# EAGLE design commutator-controller (EAGLE 8.3.2)
DESIGNER: Jon Newman, Jakob Voigts; DESIGN_NAME: Commutator Control Board; LICENSE: CC BY-NC-SA 4.0; REVISION: 1.1
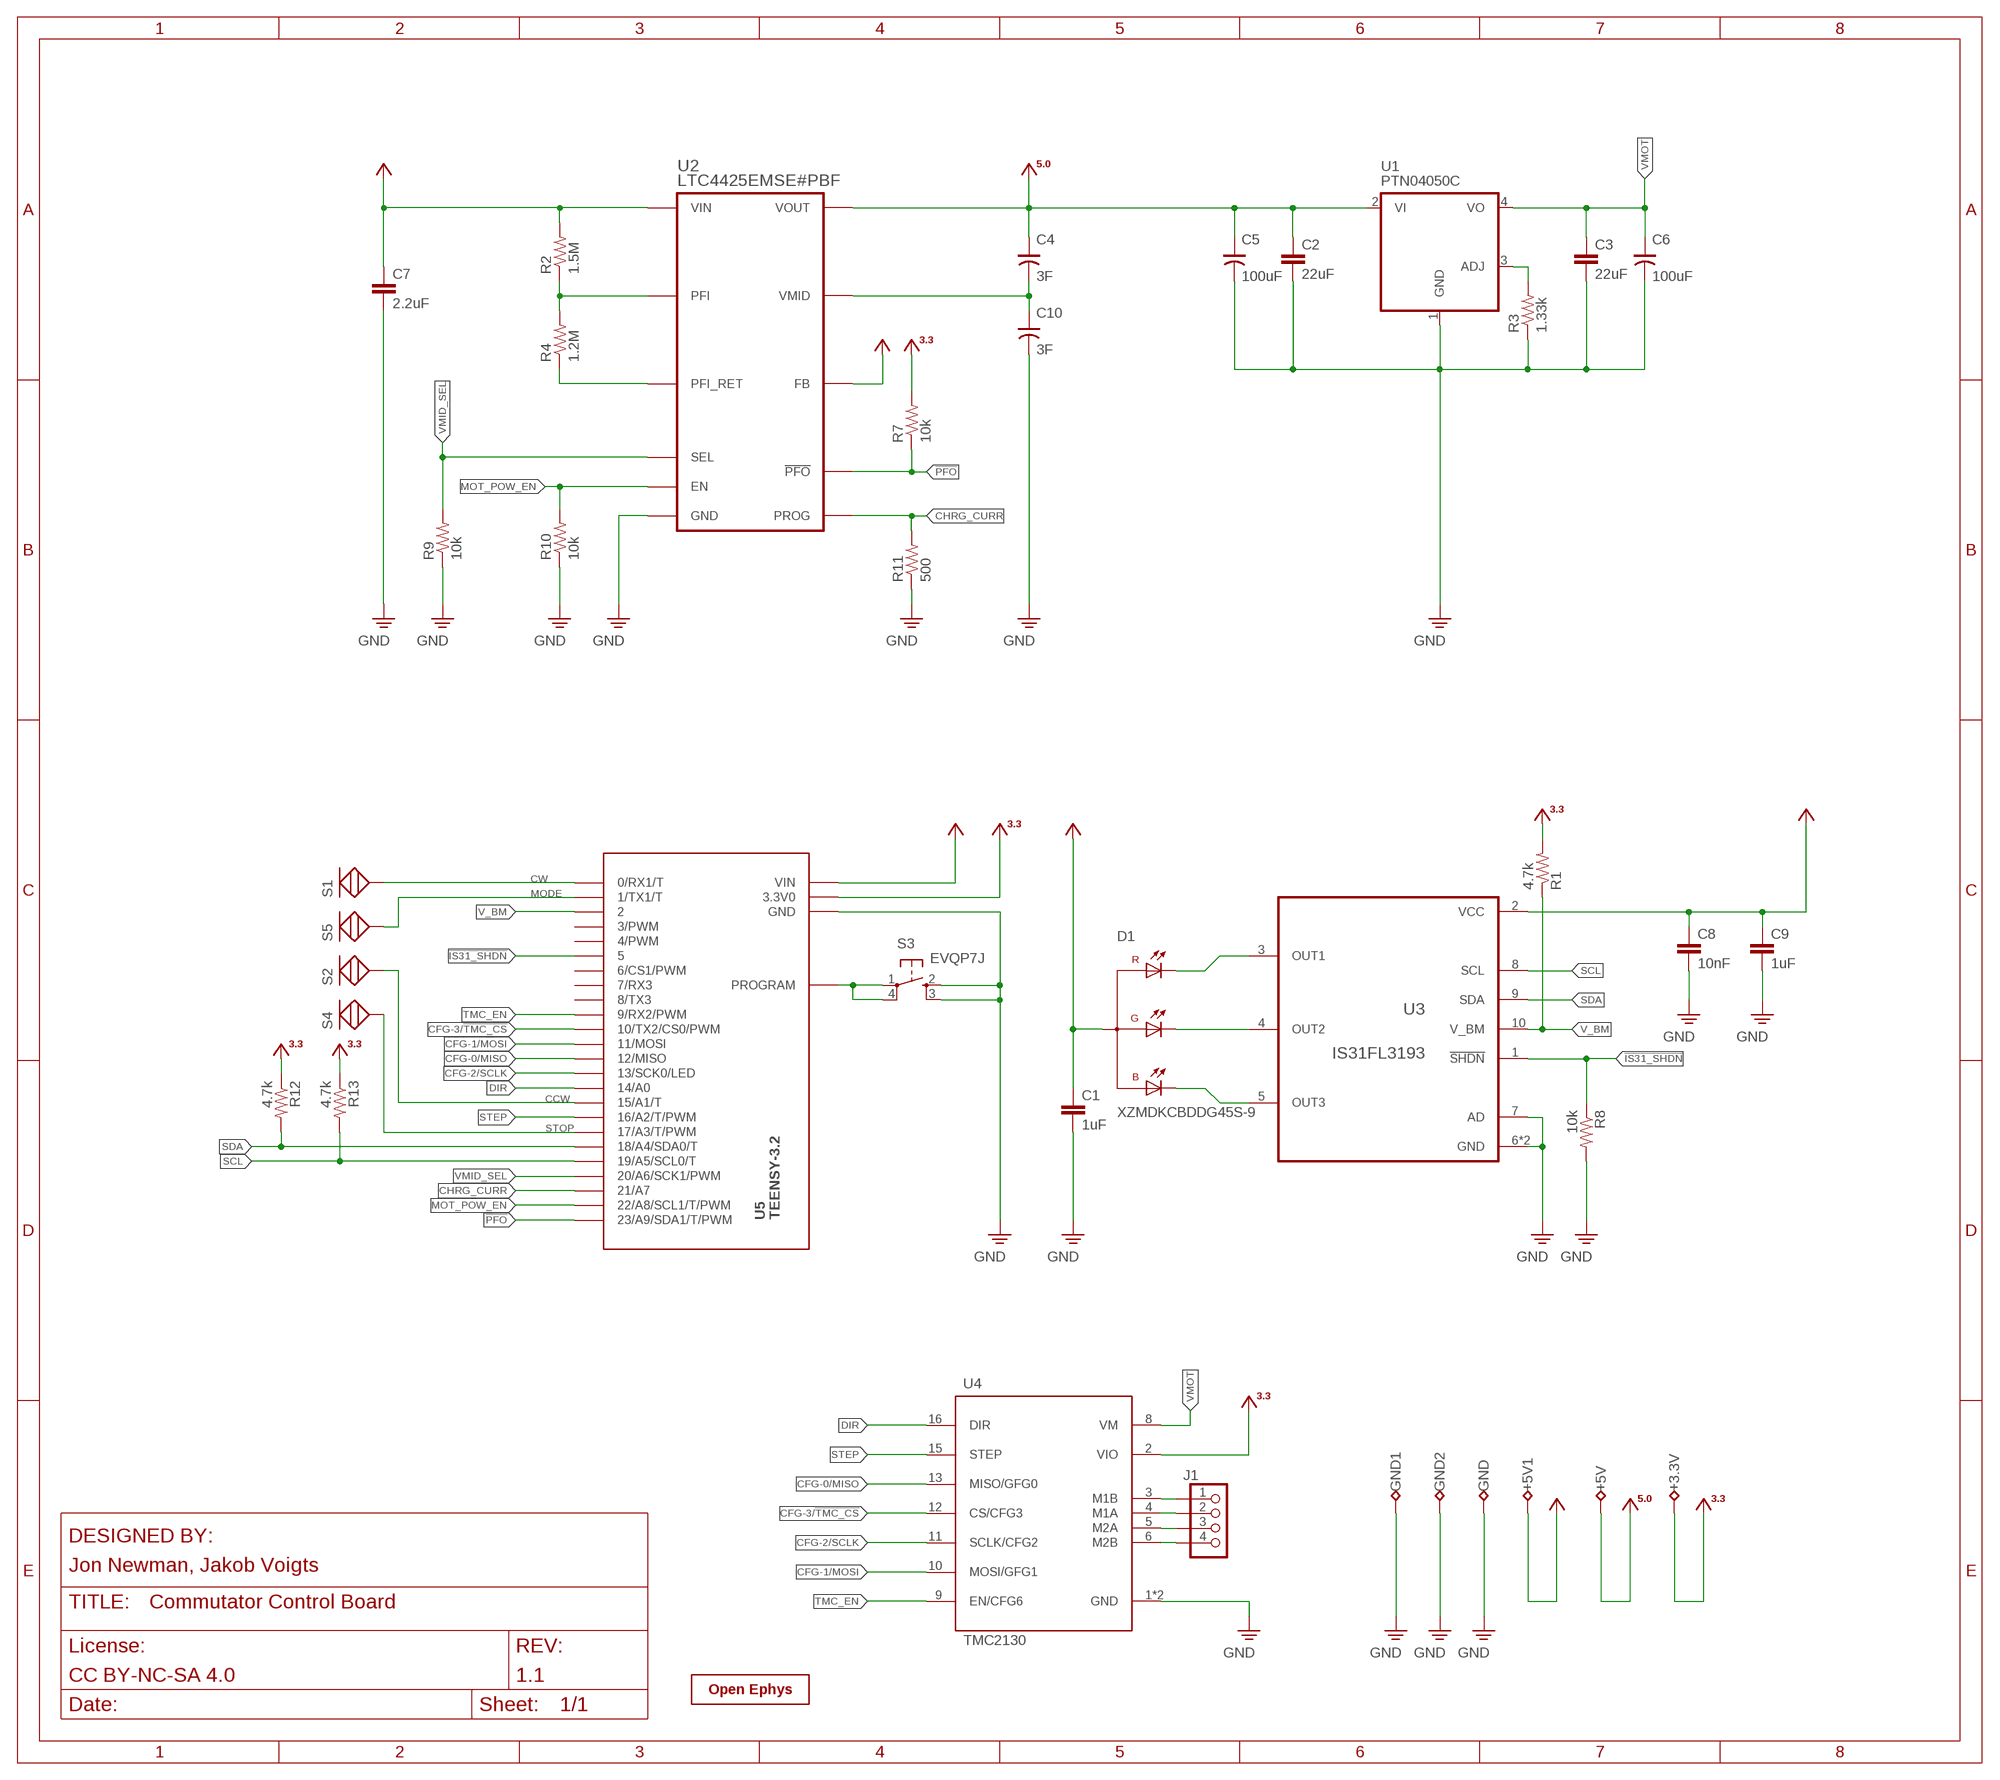
[diagram p0: schematic, sheet 1]

## Parts
+3.3V  TPB2,54  [B2,54]
+5V  TPB2,54  [B2,54]
+5V1  TPB2,54  [B2,54]
C1  1uF  C_0603  [0603]
C2  22uF  C_1206  [1206]
C3  22uF  C_1206  [1206]
C4  3F  C-POL_1210  [1210-POL]
C5  100uF  C-POL_0807  [153CLV-0807]
C6  100uF  C-POL_0807  [153CLV-0807]
C7  2.2uF  C_0805  [0805]
C8  10nF  C_0603  [0603]
C9  1uF  C_0603  [0603]
C10  3F  C-POL_1210  [1210-POL]
D1  XZMDKCBDDG45S-9  LED-RGB_PLCC-INVERTED-NOHOLE  [PLCC-INVERTED-NOHOLE]
GND  TPB2,54  [B2,54]
GND1  TPB2,54  [B2,54]
GND2  TPB2,54  [B2,54]
J1  PINHD-1X4_SMD-0.1"  [JP4_SMD]
R1  4.7k  R_0603  [0603]
R2  1.5M  R_0603  [0603]
R3  1.33k  R_0603  [0603]
R4  1.2M  R_0603  [0603]
R7  10k  R_0603  [0603]
R8  10k  R_0603  [0603]
R9  10k  R_0603  [0603]
R10  10k  R_0603  [0603]
R11  500  R_0603  [0603]
R12  4.7k  R_0603  [0603]
R13  4.7k  R_0603  [0603]
S1  TOUCH_1MM  [TOUCH-1MM]
S2  TOUCH_1MM  [TOUCH-1MM]
S3  EVQP7J  SPST_TACT_EVQP7  [EVQP7]
S4  TOUCH_1MM  [TOUCH-1MM]
S5  TOUCH_1MM  [TOUCH-1MM]
U1  PTN04050C  VREG_ADJ_R-PDSS-B4  [PDSS-B4-MODULE]
U2  LTC4425EMSE#PBF  LTC4425_MSOP  [MSOP-12-PAD]
U3  IS31FL3193  [PWSON-N10-3X3]
U4  TMC2130  SILENT-STEPPER-STICK-TMC2130_SMD  [SILENT-STEPPER-STICK-SMD]
U5  TEENSY-3.2  TEENSY_LC_SMD  [TEENSY_LC_SMD]
X1  OE-LOGO_7X5  [OE-LOGO-7X5]

## Nets
!IS31_SHDN: R8.1 U3.1(!SHDN) U5.5
!PFO: R7.1 U2.8(!PFO) U5.23(23/A9/SDA1/T/PWM)
+3V3: +3.3V.TP R1.2 R7.2 R12.1 R13.1 U4.2(VIO) U5.3.3(3.3V0) U5.3V3(3.3V0)
+5V0: +5V.TP C2.1 C4.+ C5.+ U1.2(VI) U2.1(VOUT) U2.2(VOUT)
CCW: S2.PAD U5.15(15/A1/T)
CFG-0/MISO: U4.13(MISO/GFG0) U5.12(12/MISO)
CFG-1/MOSI: U4.10(MOSI/GFG1) U5.11(11/MOSI)
CFG-2/SCLK: U4.11(SCLK/CFG2) U5.13(13/SCK0/LED)
CFG-3/!TMC_CS: U4.12(CS/CFG3) U5.10(10/TX2/CS0/PWM)
CHRG_CURR: R11.2 U2.3(PROG) U5.21(21/A7)
CW: S1.PAD U5.0(0/RX1/T)
DIR: U4.16(DIR) U5.14(14/A0)
GND: C1.2 C2.2 C3.2 C5.- C6.- C7.2 C8.2 C9.2 C10.- GND1.TP GND2.TP GND.TP R3.1 R8.2 R9.1 R10.1 R11.1 S3.2(S) S3.3(S1) U1.1(GND) U2.PAD(GND) U3.6(GND) U3.7(AD) U3.PAD(GND) U4.1(GND) U4.7(GND) U5.GND U5.GND1(GND) U5.GND2(GND)
MODE: S5.PAD U5.1(1/TX1/T)
MOT_POW_EN: R10.2 U2.6(EN) U5.22(22/A8/SCL1/T/PWM)
N$1: R4.1 U2.7(PFI_RET)
N$2: R2.1 R4.2 U2.9(PFI)
N$3: D1.1(CR) U3.3(OUT1)
N$5: J1.1 U4.3(M1B)
N$6: J1.2 U4.4(M1A)
N$7: J1.3 U4.5(M2A)
N$8: J1.4 U4.6(M2B)
N$9: R3.2 U1.3(ADJ)
N$10: D1.4(CG) U3.4(OUT2)
N$14: C4.- C10.+ U2.10(VMID)
N$45: D1.3(CB) U3.5(OUT3)
PROGRAM: S3.1(P) S3.4(P1) U5.PROGRAM
SCL: R13.2 U3.8(SCL) U5.19(19/A5/SCL0/T)
SDA: R12.2 U3.9(SDA) U5.18(18/A4/SDA0/T)
STEP: U4.15(STEP) U5.16(16/A2/T/PWM)
STOP: S4.PAD U5.17(17/A3/T/PWM)
TMC_EN: U4.9(EN/CFG6) U5.9(9/RX2/PWM)
V_BM: R1.1 U3.10(V_BM) U5.2
VCC: +5V1.TP C1.1 C7.1 C8.1 C9.1 D1.2(A) R2.2 U2.5(FB) U2.11(VIN) U2.12(VIN) U3.2(VCC) U5.VIN
VMID_SEL: R9.2 U2.4(SEL) U5.20(20/A6/SCK1/PWM)
VMOT: C3.1 C6.+ U1.4(VO) U4.8(VM)
Unconnected: U5.3(3/PWM) U5.4(4/PWM) U5.6(6/CS1/PWM) U5.7(7/RX3) U5.8(8/TX3)

## Library data of the parts
+3.3V +5V +5V1 GND GND1 GND2 = jonnew:TP: Test pad
C1-C3 C8 C9 = jonnew:C: Capacitor
C4-C6 C10 = jonnew:C-POL: Polarized Capacitor
C7 = jonnew:C: Capacitor; MN: TDK Corp.; PARTNO: C2012X5R1Cxxxxxxx; VID: DK
D1 = jonnew:LED-RGB
J1 = jonnew:PINHD-1X4
R1-R4 R7-R13 = jonnew:R: Resistor; DK: PxxxxHTR-ND; MN: Panasonic; MPN: ERJ-3EKFxxxxV
S1 S2 S4 S5 = jonnew:TOUCH
S3 = jonnew:SPST_TACT: SMT 6mm switch, EVQQ2 series http://www.ladyada.net/library/eagle
U1 = jonnew:VREG_ADJ
U2 = jonnew:LTC4425
U3 = jonnew:IS31FL3193
U4 = jonnew:SILENT-STEPPER-STICK-TMC2130
U5 = jonnew:TEENSY_LC_SMD
X1 = jonnew:OE-LOGO

## Board
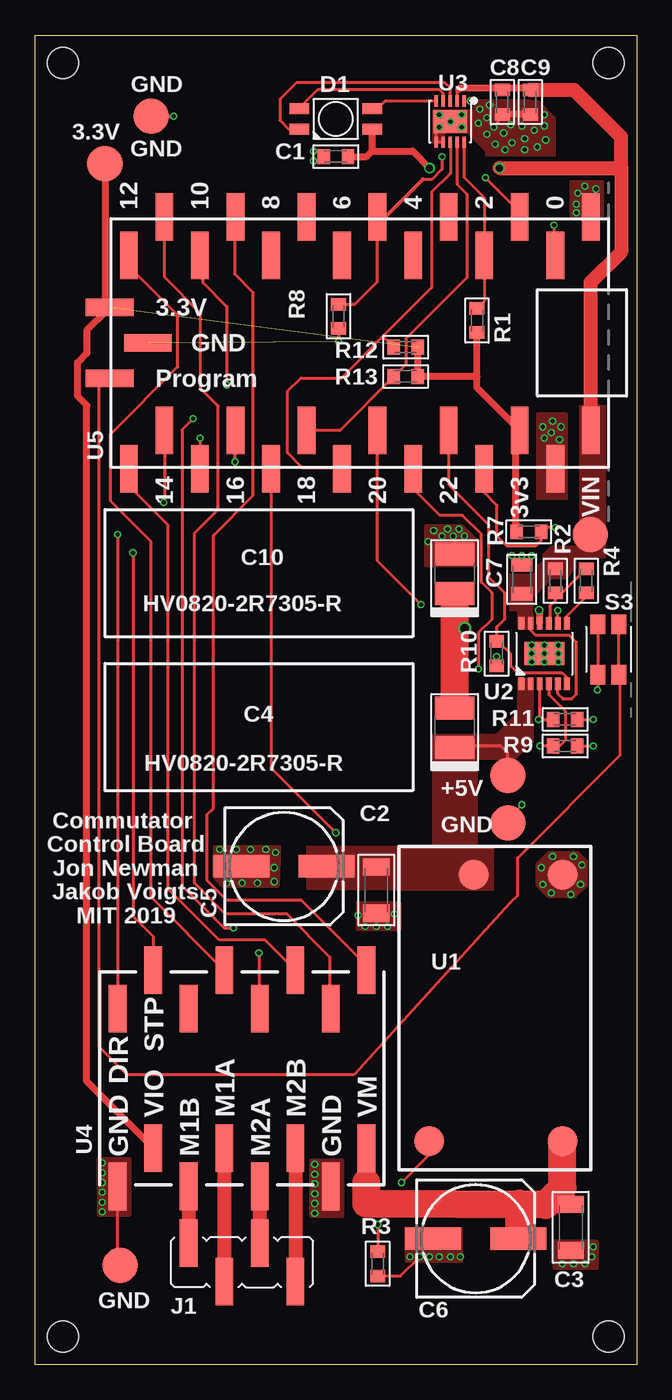
[diagram p1: board, top side]
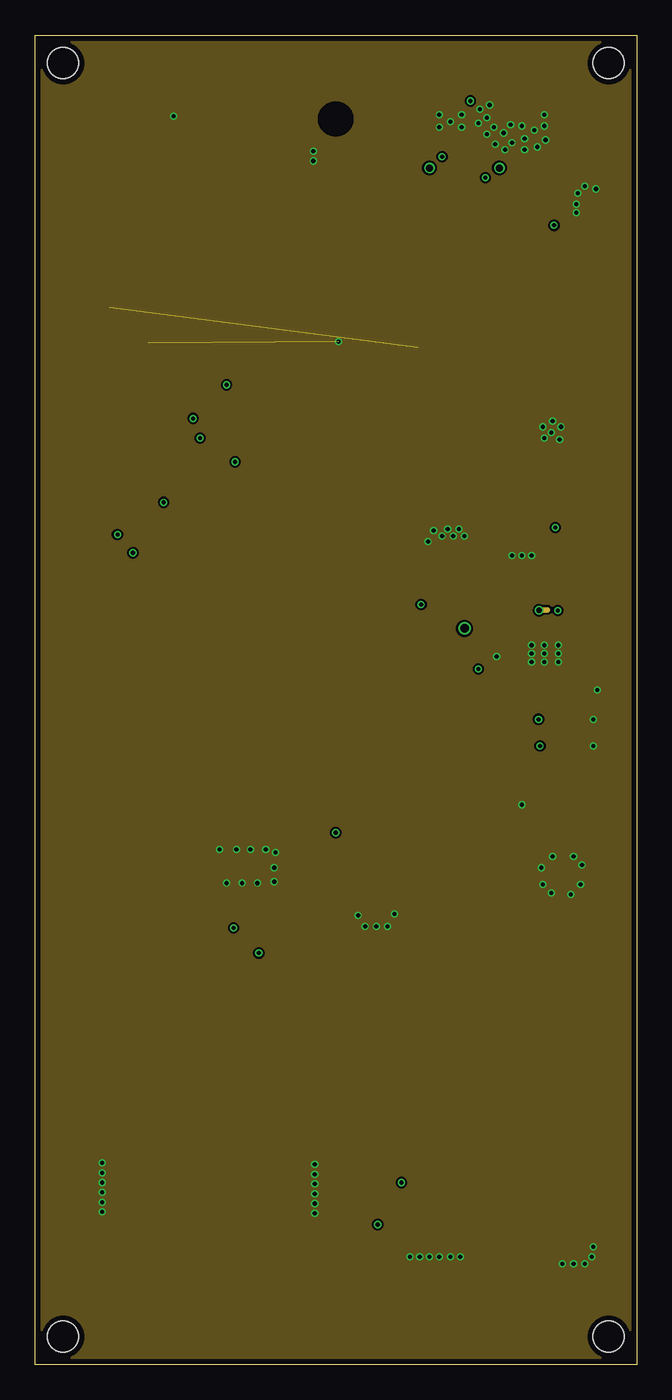
[diagram p2: board, inner layer Route2]
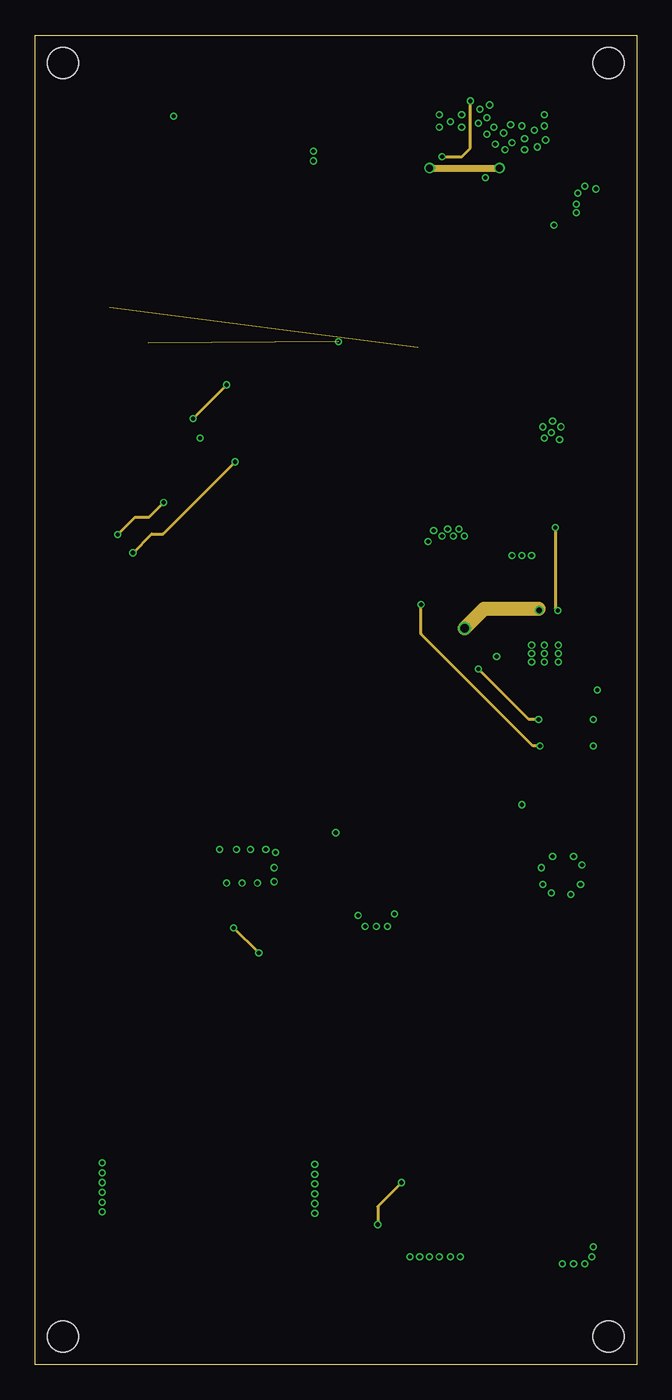
[diagram p3: board, inner layer Route15]
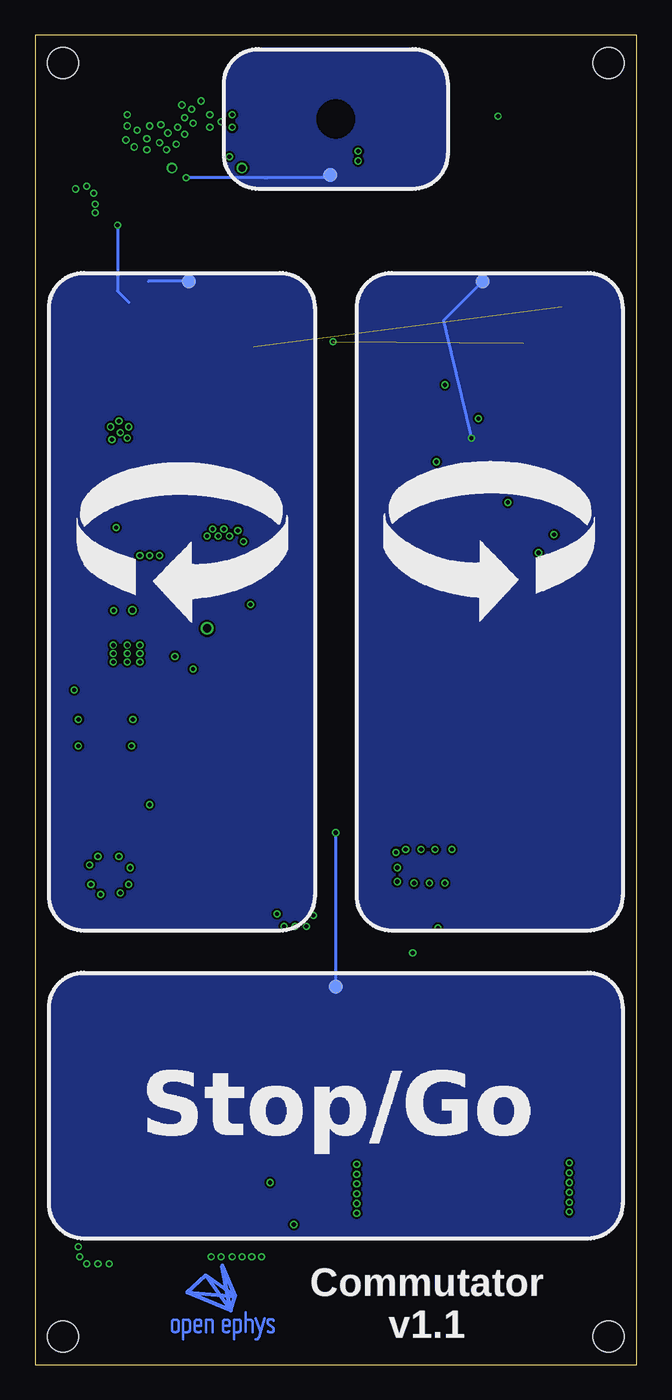
[diagram p4: board, bottom side, seen from below]

Size 43 x 95 mm. Coordinates in mm from the lower left corner, seen from the top.
Outline: 0,0 0,95 43,95 43,0 0,0
Copper layers (1*2*15*16): Top 0.035mm / dielectric 0.2mm / Route2 0.0175mm / dielectric 0.3mm / Route15 0.0175mm / dielectric 0.2mm / Bottom 0.035mm
Design rules "seeed-studio-4-layer *": minimum track width 6mil, minimum drill 0.2mm, track to track 6mil, track to pad 6mil, pad to pad 6mil, via to via 6mil, smd to smd 0mil, copper to edge 0.4mm, drill to drill 10mil, minimum pad ring 6mil, minimum via ring 4mil, stop-mask expansion 4mil, vias tented up to drill 100mil, thermal gap 10mil
Holes 2.2 mm at 2,93 2,2 41,2 41,93
tKeepout: area -1,90 to 5,96; area -1,-1 to 5,5; area 38,-1 to 44,5; area 38,90 to 44,96; area 0,92 to 43,95; area 0,0 to 3,95; area 0,0 to 43,3; area 40,0 to 43,43

### Footprints (pad centres in the part's own frame; a part is rotated, then mirrored left to right if it is on the bottom)
B2,54 = smd 2.54 x 2.54: TP 0,0
0603 = smd 0.889 x 1.067: 1 -0.864,0; 2 0.864,0
1206 = smd 1.219 x 1.88: 1 -1.651,0; 2 1.651,0
1210-POL = smd 1.651 x 2.794: + -1.397,0; - 1.397,0
153CLV-0807 = smd 4 x 1.6: + 3.05,0; - -3.05,0
0805 = smd 0.965 x 1.524: 1 -1.041,0; 2 1.041,0
PLCC-INVERTED-NOHOLE = smd 1.4 x 0.8: 1 2.6,0.725; 2 -2.6,0.725; 3 -2.6,-0.725; 4 2.6,-0.725
JP4_SMD = smd 1.27 x 3.4: 1 -3.81,1.37; 2 -1.27,-1.37; 3 1.27,1.37; 4 3.81,-1.37
TOUCH-1MM = smd 1 x 1: PAD 0,0
EVQP7 = smd 1.4 x 1.05: 1 -1.8,0.725; 2 -1.8,-0.775; 3 1.8,-0.775; 4 1.8,0.725
PDSS-B4-MODULE = smd 2.159 x 2.159: 1 0,0; 2 0,-6.35; 3 19.05,-9.525; 4 19.05,0
MSOP-12-PAD = smd 0.889 x 0.42: 1 -2.155,1.625; 2 -2.155,0.975; 3 -2.155,0.325; 4 -2.155,-0.325; 5 -2.155,-0.975; 6 -2.155,-1.625; 7 2.155,-1.625; 8 2.155,-0.975; 9 2.155,-0.325; 10 2.155,0.325; 11 2.155,0.975; 12 2.155,1.625 | smd 1.651 x 2.845: PAD 0,0
PWSON-N10-3X3 = smd 0.8 x 0.28: 1 -1.475,1; 2 -1.475,0.5; 3 -1.475,0; 4 -1.475,-0.5; 5 -1.475,-1; 6 1.475,-1; 7 1.475,-0.5; 8 1.475,0; 9 1.475,0.5; 10 1.475,1 | smd 1.65 x 2.4: PAD 0,0
SILENT-STEPPER-STICK-SMD = smd 3.4 x 1.27: 1 -1.37,8.89; 2 1.37,6.35; 3 -1.37,3.81; 4 1.37,1.27; 5 -1.37,-1.27; 6 1.37,-3.81; 7 -1.37,-6.35; 8 1.37,-8.89; 9 14.07,-8.89; 10 11.33,-6.35; 11 14.07,-3.81; 12 11.33,-1.27; 13 14.07,1.27; 14 11.33,3.81; 15 14.07,6.35; 16 11.33,8.89
TEENSY_LC_SMD = smd 3.4 x 1.27: 0 6.25,3.81; 1 8.99,6.35; 2 6.25,8.89; 3 8.99,11.43; 3V3 -6.25,6.35; 4 6.25,13.97; 5 8.99,16.51; 6 6.25,19.05; 7 8.99,21.59; 8 6.25,24.13; 9 8.99,26.67; 10 6.25,29.21; 11 8.99,31.75; 12 6.25,34.29; 13 -8.99,34.29; 14 -6.25,31.75; 15 -8.99,29.21; 16 -6.25,26.67; 17 -8.99,24.13; 18 -6.25,21.59; 19 -8.99,19.05; 20 -6.25,16.51; 21 -8.99,13.97; 22 -6.25,11.43; 23 -8.99,8.89; GND -8.99,3.81; GND1 8.99,1.27; VIN -6.25,1.27 | smd 1.27 x 3.4: 3.3 2.54,35.66; GND2 0,32.92; PROGRAM -2.54,35.66

### Placement (x,y rotation side)
+3.3V  5,85.8 0 top
+5V  33.8,42.1 0 top
+5V1  39.7,59.3 0 top
C1  21.51,86.31 180 top
C2  24.4,33.9 270 top
C3  38.3,9.8 270 top
C4  30,45.5 90 top
C5  17.8,35.6 0 top
C6  31.5,9 0 top
C7  34.8,56.1 90 top
C8  33.4,90.2 270 top
C9  35.4,90.2 270 top
C10  30,56.5 90 top
D1  21.5,89 180 top
GND  8.3,89.2 0 top
GND1  6.1,7.1 0 top
GND2  33.8,38.7 0 top
J1  14.8,7.3 0 top
R1  31.6,74.6 270 top
R2  37.2,56 90 top
R3  24.5,7.2 90 top
R4  39.4,56 90 top
R7  35.3,59.5 180 top
R8  21.7,74.9 270 top
R9  37.9,44.2 180 top
R10  33,50.8 90 top
R11  37.9,46.1 180 top
R12  26.5,70.6 180 top
R13  26.5,72.7 180 top
S1  32,77.4 0 bottom
S2  11,77.4 0 bottom
S3  41,51.1 270 top
S4  21.5,27 0 bottom
S5  21.9,85 0 bottom
U1  37.7,35 270 top
U2  36.4,50.8 90 top
U3  29.68,88.81 270 top
U4  14.8,14.1 90 top
U5  41,73 90 top
X1  29.91,3.66 0 bottom

### Tracks (layer width: path | path; a pad name or v marks a point on that pad's centre or on a via)
!IS31_SHDN  (via drill 0.3)
  Top 0.2: U3.1 v31.12,90.28 | v29.1,86.3 29.1,85.4 28.4,84.7 27.8,84.7 | 24.49,81.5 U5.5 25.09,81.99 27.8,84.7 | 27.8,84.7 27.69,84.7 24.49,81.5 | R8.1 22.86,75.76 24.49,77.39 24.49,81.5
  Route15 0.2: v29.1,86.3 30.5,86.3 31.12,86.92 v31.12,90.28
!PFO  (via drill 0.3)
  Top 0.2: U5.23 32.11,62.3 33.02,61.39 33.02,59.2 33.72,58.5 35.8,58.5 36.16,58.86 R7.1 36.26,59.8 v37.2,59.8 | U2.8 v37.38,53.88
  Route15 0.2: v37.2,59.8 37.2,54.05 v37.38,53.88
+3V3  (1 unrouted)
  Top 0.5: U4.2 3.7,20.22 3.7,68.54 3.04,69.2 3.04,71.6 3.7,72.26 3.7,73.9 5,75.2 | 5,75.2 U5.3.3 | +3.3V.TP 5,75.2 | 31.6,70.6 31.6,69.8 U5.3V3 34.38,66.47 34.38,60.06 R7.2 | 31.6,70.6 R1.2 | 31.6,70.6 R12.1 R13.1
+5V0
  Top 0.2: +5V.TP 33.8,43.7 33.3,44.2 30.1,44.2 C4.+
  Top 0.5: C4.+ 30.5,44.6
  pour Top (no thermals): 28.5,37 28.5,45 33,45 34.6,46.6 34.6,49 35.5,49 35.5,44.5 34.3,43.3 31.5,43.3 31.5,37 32.7,36.9 32.7,33.9 19.5,34 19.5,37
CCW  (via drill 0.3)
  Top 0.2: v11.8,66.2 U5.15
  Bottom 0.2: S2.PAD 13.8,74.6 v11.8,66.2
  pour Bottom (no thermals): 1,75.5 1,33.5 arc90 3.5,31 17.5,31 arc90 20,33.5 20,75.5 arc90 17.5,78 3.5,78 arc90
CFG-0/MISO
  Top 0.2: U4.13 8.3,33.4 8.3,58.8 5.4,61.7 5.4,66.5 10.2,71.3 10.2,75 6.71,78.49 U5.12
CFG-1/MOSI
  Top 0.2: 21.1,26.3 21.1,29.1 18,32.2 13.6,32.2 11.4,34.4 11.4,59.4 13.1,61.1 13.1,68.5 11.85,69.75 11.85,75.1 9.25,77.7 U5.11 | 21.1,26.3 21.1,24.9 | U4.10 21.15,26.25 21.1,26.3
CFG-2/SCLK
  Top 0.2: U4.11 16.44,30.34 13.16,30.34 9.5,34 9.5,60 6.71,62.79 U5.13
CFG-3/!TMC_CS  (via drill 0.3)
  Top 0.2: U4.12 16,25.5 v16,29.4 | v14.2,31.2 13.5,31.2 10.5,34.2 10.5,66.8 v11.3,67.6 | U5.10 11.82,79.25 11.82,79.82 12,80 12,77.3 13.7,75.6 v13.7,70
  Route15 0.2: v16,29.4 v14.2,31.2 | v13.7,70 v11.3,67.6
CHRG_CURR  (via drill 0.3)
  Top 0.2: v31.7,49.7 31.7,52.3 32.65,53.25 32.65,55.15 31.9,55.9 31.9,59.33 30.57,60.66 28.93,60.66 27,62.6 27,63.81 27.2,64.01 U5.21 | R11.2 v36,46.1 36.08,46.17 U2.3
  Route15 0.2: v36,46.1 35.3,46.1 v31.7,49.7
CW  (via drill 0.3)
  Top 0.2: v37.1,81.4 37.1,79.34 U5.0
  Bottom 0.2: S1.PAD 34.9,77.4 | v37.1,81.4 37.1,76.7 36.3,75.9
  pour Bottom (no thermals): 42,33.5 42,75.5 arc90 39.5,78 25.5,78 arc90 23,75.5 23,33.5 arc90 25.5,31 39.5,31 arc90
DIR  (via drill 0.3)
  Top 0.2: U5.14 9.25,61.65 v9.2,61.6 | v5.9,59.3 U4.16
  Route15 0.2: v5.9,59.3 7.15,60.55 8.15,60.55 v9.2,61.6
GND  (via drill 0.3)  (1 unrouted)
  Top 0.2: GND.TP v9.9,89.2 | C7.2 34.76,57.14 v34.1,57.8 | C7.2 v34.8,57.8 | C7.2 34.84,57.14 v35.5,57.8 | R10.1 v33,50.6 | R11.1 v39.9,46.1 | R9.1 v39.9,44.2 | GND2.TP 33.8,39 v34.8,40 | GND1.TP 5.91,7.29 U4.1 | v19.9,86.7 20.65,86.6 C1.2 20.65,86.1 v19.9,86 | U5.GND1 40.1,81.89 v40.1,84 | C10.- 30,58.8 v29.9,59.2 | S3.2 S3.3 40.23,48.23 v40.2,48.2 | v27.5,7.7 26.14,6.34 R3.1 | U3.7 U3.6 28.68,88.38 28.7,88.4 | C8.2 33.6,89.4 v32.8,88.4 | R8.2 v21.7,73.1
  Top 0.5: C9.2 C8.2
  other vias: 31.7,88.7 29.7,88.8 30.5,88.4 30.5,89.3 36.5,87.5 32.9,87.2 33.5,88 32.5,90 35.5,51.4 36.4,51.4 37.4,51.4 37.4,50.8 36.4,50.8 35.5,50.8 37.4,50.2 36.4,50.2 35.5,50.2 36.2,35.5 36.3,34.3 36.9,33.7 38.3,33.6 39,34.3 39.1,35.7 38.5,36.3 37,36.3 23.6,31.3 24.4,31.3 25.2,31.3 13.2,36.8 14.4,36.8 15.4,36.8 16.5,36.8 17.2,36.6 17.1,35.5 17.1,34.5 14.8,34.4 13.7,34.4 23.1,32.1 25.7,32.2 15.9,34.4 28.2,7.7 28.9,7.7 26.8,7.7 29.7,7.7 30.4,7.7 37.7,7.2 38.5,7.2 39.3,7.2 39.8,7.7 39.9,8.4 20,13.6 20,12.9 20,12.2 20,14.3 20,11.5 20,10.8 4.8,13.7 4.8,13 4.8,12.3 4.8,14.4 4.8,11.6 4.8,10.9 34,88.6 34.8,88.5 35.7,88.2 36.4,89.3 36.4,88.5 34.1,87.3 31.8,89.7 35,87.6 32.3,87.9 32.3,89.1 35.9,87 39.3,84.2 38.8,83.7 38.7,82.9 38.7,82.3 37,67.4 36.9,66.6 36.3,67 37.6,67 37.5,66.1 36.4,66.2 30.7,59.2 29.1,59.2 30.3,59.7 28.5,59.6 28.1,58.8 29.5,59.7 33.6,86.8 35,86.8 28.9,89.3 28.9,88.4
  pour Route2 (rank 2, no thermals): -11,-9 -11,100 56,100 56,-9
  pour Top (no thermals): 35.9,34.2 35.9,35.8 36.7,36.6 38.8,36.6 39.4,36 39.4,34.2 38.6,33.4 36.7,33.4
  pour Top (no thermals): 23,33 23,31.1 26.1,31.1 26.1,33
  pour Top (no thermals): 12.8,37 12.8,34.89 13.39,34.2 17.4,34.2 17.5,37
  pour Top (no thermals): 26.5,9.7 26.5,7.4 30.5,7.4 30.5,9.7
  pour Top (no thermals): 37.1,8.8 37.1,6.9 40.2,6.9 40.2,8.8
  pour Top (no thermals): 6.8,14.7 4.5,14.7 4.5,10.7 6.8,10.7
  pour Top (no thermals): 22,14.6 19.7,14.6 19.7,10.6 22,10.6
  pour Top (no thermals): 40.6,84.5 38.3,84.5 38.3,82.1 40.6,82.1
  pour Top (no thermals): 35.9,67.9 35.9,61.9 38,61.9 38,67.9
  pour Top (no thermals): 31.5,57.1 31.5,59 30.6,59.9 27.9,59.9 27.9,57.1
  pour Top (no thermals): 29.2,87.3 28.5,87.3 28.5,89.6 31.4,89.6 31.4,90.3 35.9,90.3 37.1,89.1 37.1,86.4 32.3,86.4 32.3,86.7 30.9,88.1 29.2,88.1
MODE  (via drill 0.3)
  Top 0.2: U5.1 34.65,82.35 v32.2,84.8
  Bottom 0.2: 26.6,84.8 v32.2,84.8 | 26.6,84.8 26.4,84.8 | S5.PAD 22.1,84.8 26.6,84.8
  pour Bottom (no thermals): 16,94 27,94 arc-90 29.5,91.5 29.5,86.5 arc-90 27,84 16,84 arc-90 13.5,86.5 13.5,91.5 arc-90
MOT_POW_EN
  Top 0.2: U2.6 38.02,49.08 37.7,49.4 34.5,49.4 34,49.9 34,50.76 33.1,51.66 R10.2 33,52.7 33.55,53.25 33.55,55.15 32.45,56.25 32.45,60 29.57,62.88 U5.22
N$1
  Top 0.2: U2.7 38.02,53.5 39.4,54.88 R4.1
N$2
  Top 0.2: U2.9 36.8,53.03 36.8,54.2 37.2,54.6 R2.1 37.67,55.14 R4.2
N$3
  Top 0.2: U3.3 29.68,91.22 29.3,91.6 18.7,91.6 17.5,90.4 17.5,88.9 18.12,88.28 D1.1
N$5
  Top 1: U4.3 J1.1
N$6
  Top 1: U4.4 J1.2
N$7
  Top 1: U4.5 J1.3
N$8
  Top 1: U4.6 J1.4
N$9  (via drill 0.3)
  Top 0.2: v24.5,10 R3.2 | U1.3 28.18,14.97 v26.2,13
  Route15 0.2: v26.2,13 24.5,11.3 v24.5,10
N$10
  Top 0.2: U3.4 29.18,90.82 28.9,91.1 20.2,91.1 18.9,89.8 D1.4
N$11
  cutout Route2: 20.3,89 arc-90 21.5,90.2 arc-90 22.7,89 arc-90 21.5,87.8 arc-90
N$13
  cutout Bottom: 22.8,89 arc-90 21.5,87.7 arc-90 20.2,89 arc-90 21.5,90.3 arc-90
N$14  (via drill 0.4, 0.6)
  Top 0.4: 30.5,54 30.5,54.5 30,54.5
  Top 0.5: U2.10 36.08,53.9 v36.03,53.9
  Top 1: C10.+ 30,54.5 30,53.6 v30.7,52.6 | C4.- 30,47.5
  Top 2: 30,47.5 30,54.5
  Route2 0.4: 36.63,53.91 v36.03,53.9
  Route15 0.2: v36.03,53.9 36.03,53.97 36,54
  Route15 1: 36,54 32.1,54 v30.7,52.6
N$45
  Top 0.2: D1.3 24.49,89.75 25.02,90.28 U3.5
PROGRAM
  Top 0.2: U5.PROGRAM 5.8,70.46 5.8,70.6 4.6,70.6 4.6,22.7 6.6,20.7 22.8,20.7 33.98,33.01 34.5,33.53 34.5,36.2 41.84,43.54 41.84,49.19 S3.4 S3.1
SCL
  Top 0.2: 25.54,72.8 R13.2 24.89,73.45 24.85,73.45 | 24.85,73.45 21.9,70.5 19,70.5 18.05,69.55 18.05,65.15 19.1,64.1 21.86,64.1 U5.19 | U3.8 29.68,85.1 28.34,83.76 28.34,76.94 24.85,73.45
SDA
  Top 0.2: U5.18 21.79,66.75 R12.2 26.5,71.46 26.5,73.3 30.9,77.7 30.9,83.6 30.18,84.32 U3.9
STEP  (via drill 0.3)
  Top 0.2: U4.15 8.45,30.57 7,32.02 v7,58 | v14.3,64.5 14.3,66.72 U5.16
  Route15 0.2: v7,58 8.35,59.35 9.15,59.35 v14.3,64.5
STOP  (via drill 0.3)
  Top 0.2: U5.17 16.87,42.63 v21.5,38
  Bottom 0.2: S4.PAD v21.5,38
  pour Bottom (no thermals): 3.5,9 39.5,9 arc90 42,11.5 42,25.5 arc90 39.5,28 3.5,28 arc90 1,25.5 1,11.5 arc90
TMC_EN
  Top 0.2: U4.9 23.69,28.51 19,33.2 13.7,33.2 12.3,34.6 12.3,39.3 12.75,39.75 12.75,59.25 15.6,62.1 15.6,76.6 14.3,77.9 14.3,81.96 U5.9
V_BM
  Top 0.2: U3.10 30.68,84.82 32.11,83.39 U5.2 32.11,75.97 R1.1
VCC  (via drill 0.5)
  Top 0.2: 33.6,91.2 C8.1 | U3.2 30.2,90.31 30.2,91 30.3,91.1 | C9.1 35.7,91.06 | C7.1 35.4,55.06 | U2.5 37.38,47.92 37.75,47.55 38.35,47.55 38.7,47.9 38.7,51.6 38.2,52.1 35.8,52.1 35.42,52.48 U2.11
  Top 0.5: C9.1 35.26,91.2 33.6,91.2 | C8.1 33.53,91.2 30.4,91.2 30.3,91.1 | 36.5,91.06 36.2,91.06 | D1.2 24.1,86.7 | 38,85.5 v33.2,85.5 | C1.1 23.71,86.31 24.1,86.7 | v28.2,85.5 27,86.7 24.1,86.7
  Top 1: 36.2,91.06 C9.1 | U5.VIN 39.73,77.33 41.9,79.5 41.9,85.6 | 41.9,85.6 41.9,87.7 38.54,91.06 36.5,91.06 | v33.2,85.5 41.8,85.5 41.9,85.6
  Route15 0.5: v28.2,85.5 v33.2,85.5
  pour Top (no thermals): 39,68.5 40.7,68.5 40.7,57.7 38.6,57.7 38.6,56.9 37.9,56.2 36.9,56.2 35.5,54.8 35.5,52.6 34.6,52.6 34.6,53.9 34,53.9 34,57.1 36.1,57.1 36.4,57.4 36.4,57.9 36.9,58.4 39,58.4
VMID_SEL  (via drill 0.3)
  Top 0.2: 37.04,44.66 R9.2 | R9.2 v36.1,44.2 | v27.6,54.3 24.49,57.41 U5.20 | R9.2 37.5,44.2 37.9,44.6 37.9,46.7 36.73,47.88 U2.4
  Route15 0.2: v36.1,44.2 35.6,44.2 27.6,52.2 v27.6,54.3
VMOT
  Top 0.2: C3.1 37.7,12.55 37.7,12.6
  Top 1: 37.4,15.65 U1.4 | 34.6,9 C6.+ | 23.69,13 U4.8 | 23.69,11.5 34.6,11.5 37.58,11.51 C3.1 | 34.6,9.5 34.6,9 | 34.6,9 34.8,9
  Top 2: U1.4 37.7,12.6 36.5,11.41 23.69,11.5 23.69,13 | 34.6,11.5 34.6,9.5

### Text on the board
tPlace: GND | 3.3V | HV0820-2R7305-R | HV0820-2R7305-R | GND | Commutator / Control Board / Jon Newman / Jakob Voigts / MIT 2019 | GND
bPlace: Commutator / v1.1